# EAGLE schematic QS18-30-1 (EAGLE 6.1)
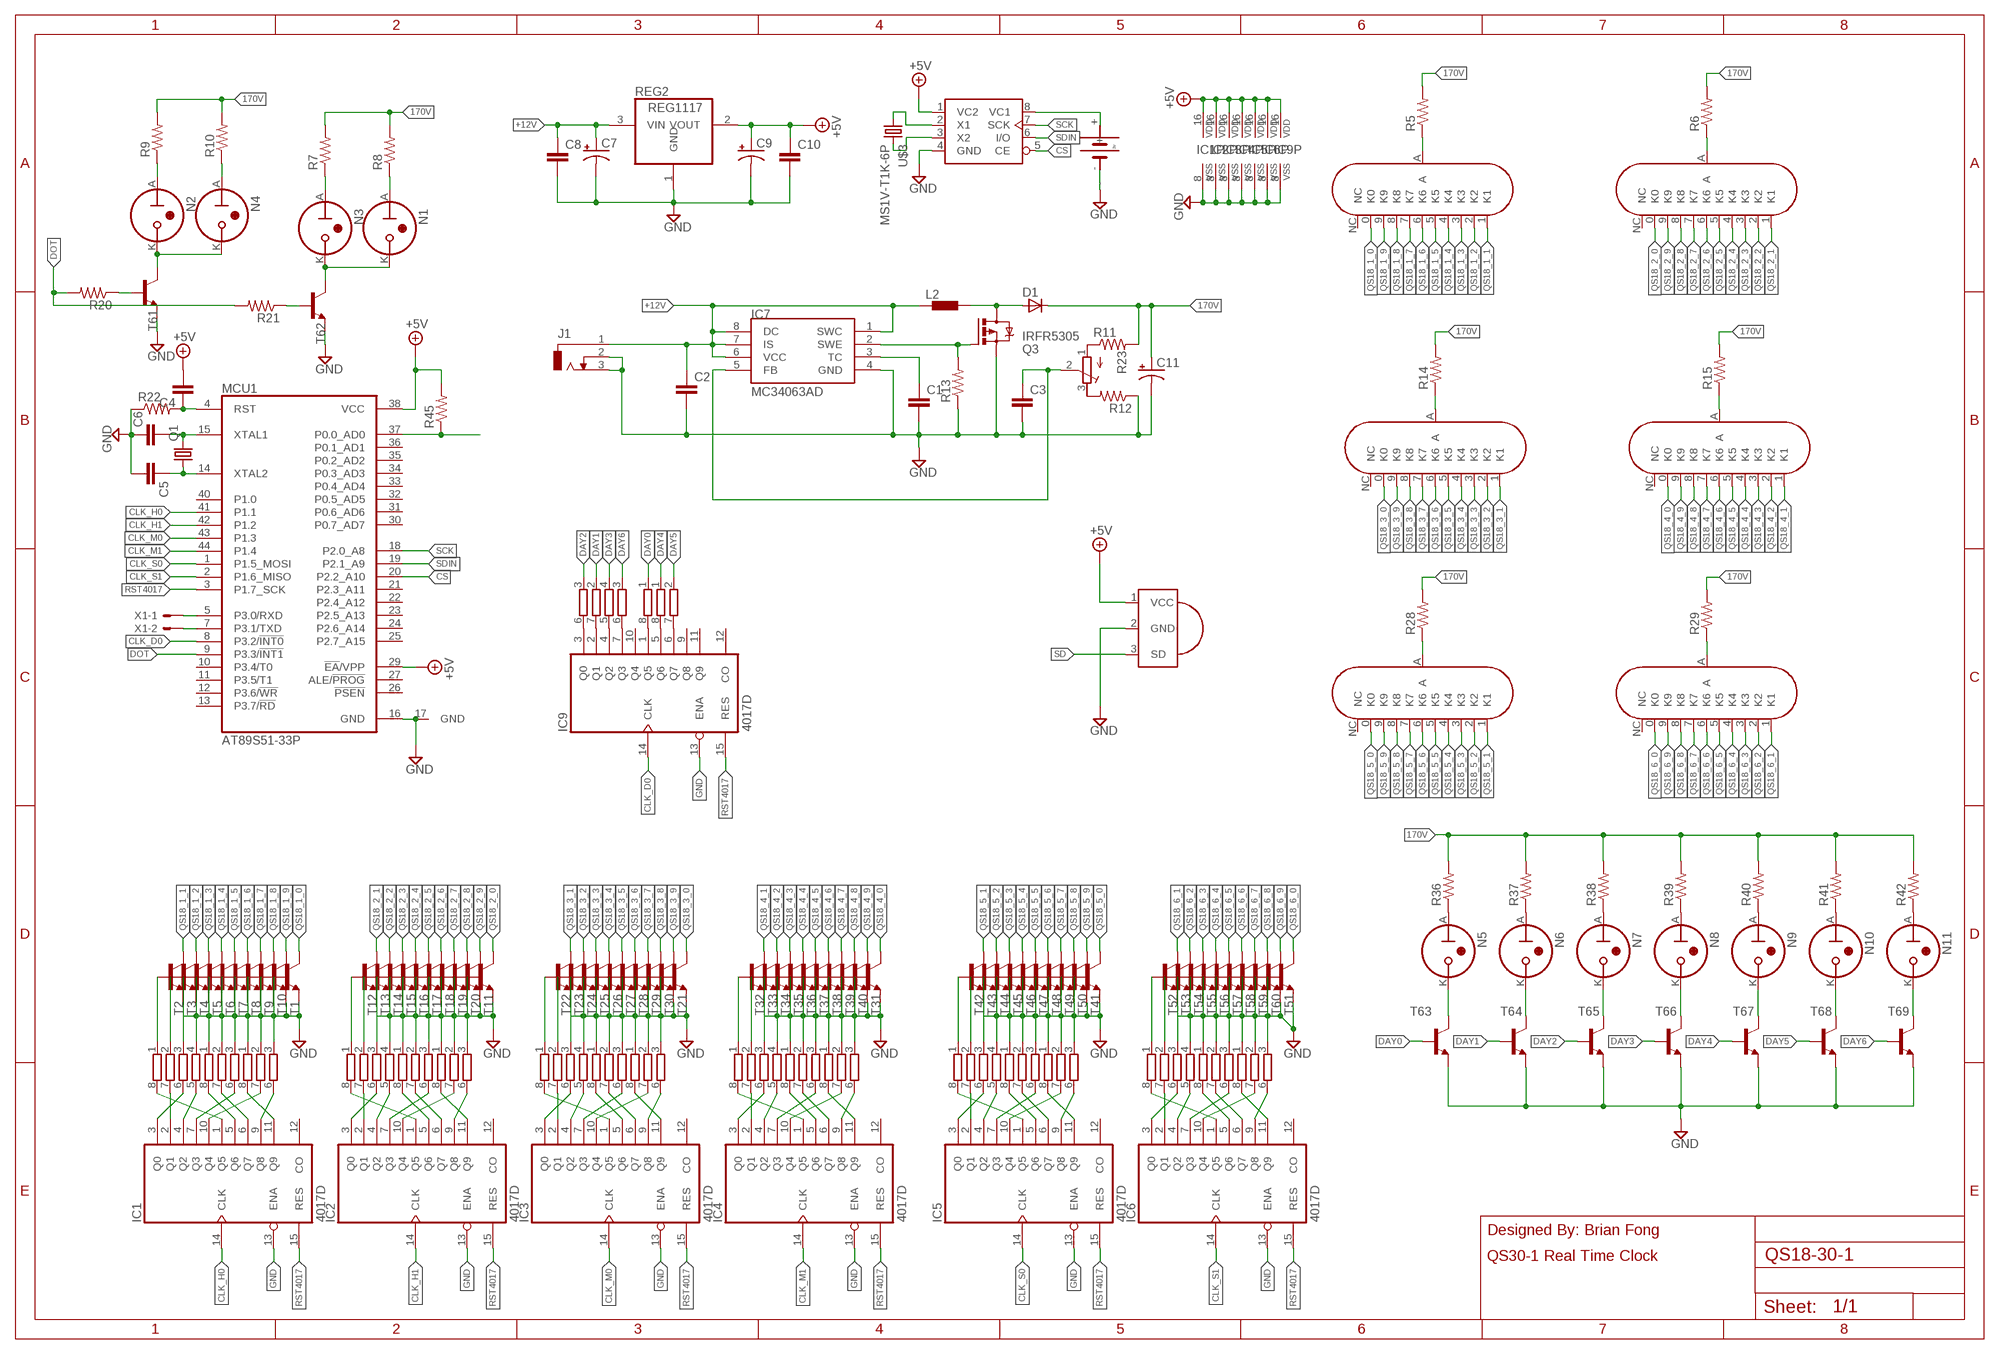
[diagram p0: schematic, sheet 1]

## Parts
C1  C-EUC0805  [C0805]
C2  C-EUC0805  [C0805]
C3  C-EUC0805  [C0805]
C4  C-EUC1206  [C1206]
C5  C-EUC0805  [C0805]
C6  C-EUC0805  [C0805]
C7  CPOL-USB/3528-21R  [B/3528-21R]
C8  C-EUC0805  [C0805]
C9  CPOL-USB/3528-21R  [B/3528-21R]
C10  C-EUC0805  [C0805]
C11  CPOL-USG  [PANASONIC_G]
D1  D-SMB  [SMB]
IC1  4017D  [SO16]
IC2  4017D  [SO16]
IC3  4017D  [SO16]
IC4  4017D  [SO16]
IC5  4017D  [SO16]
IC6  4017D  [SO16]
IC7  MC34063AD  [SOIC8]
IC9  4017D  [SO16]
J1  DCJ0303  [DCJ0303]
L2  DR10301033  [DR1033]
MCU1  AT89S51-33P  [TQFP44]
N1  IN-3  [IN-3]
N2  IN-3  [IN-3]
N3  IN-3  [IN-3]
N4  IN-3  [IN-3]
N5  IN-3  [IN-3]
N6  IN-3  [IN-3]
N7  IN-3  [IN-3]
N8  IN-3  [IN-3]
N9  IN-3  [IN-3]
N10  IN-3  [IN-3]
N11  Mon  IN-3  [IN-3]
Q1  CRYSTALHC49UP  [HC49UP]
Q3  IRFR5305  [D-PAK_TO252AA]
R1  4R-NEXB38V  [EXB38V]
R2  4R-NEXB38V  [EXB38V]
R3  4R-NEXB38V  [EXB38V]
R4  4R-NEXB38V  [EXB38V]
R5  R-US_M0805  [M0805]
R6  R-US_M0805  [M0805]
R7  R-US_M0805  [M0805]
R8  R-US_M0805  [M0805]
R9  R-US_M0805  [M0805]
R10  R-US_M0805  [M0805]
R11  R-US_R0805  [R0805]
R12  R-US_R0805  [R0805]
R13  R-US_R0805  [R0805]
R14  R-US_M0805  [M0805]
R15  R-US_M0805  [M0805]
R16  4R-NEXB38V  [EXB38V]
R17  4R-NEXB38V  [EXB38V]
R18  4R-NEXB38V  [EXB38V]
R19  4R-NEXB38V  [EXB38V]
R20  R-US_M0805  [M0805]
R21  R-US_M0805  [M0805]
R22  R-US_M0805  [M0805]
R23  R-TRIMM3374  [RTRIM3374]
R24  4R-NEXB38V  [EXB38V]
R25  4R-NEXB38V  [EXB38V]
R26  4R-NEXB38V  [EXB38V]
R27  4R-NEXB38V  [EXB38V]
R28  R-US_M0805  [M0805]
R29  R-US_M0805  [M0805]
R30  4R-NEXB38V  [EXB38V]
R31  4R-NEXB38V  [EXB38V]
R32  4R-NEXB38V  [EXB38V]
R33  4R-NEXB38V  [EXB38V]
R34  4R-NEXB38V  [EXB38V]
R35  4R-NEXB38V  [EXB38V]
R36  R-US_M0805  [M0805]
R37  R-US_M0805  [M0805]
R38  R-US_M0805  [M0805]
R39  R-US_M0805  [M0805]
R40  R-US_M0805  [M0805]
R41  R-US_M0805  [M0805]
R42  R-US_M0805  [M0805]
R43  4R-NEXB38V  [EXB38V]
R44  4R-NEXB38V  [EXB38V]
R45  R-US_M0805  [M0805]
REG2  REG1117  [SOT223]
T1  MMBT5551LT1-NPN-SOT23-BEC  [SOT23-BEC]
T2  MMBT5551LT1-NPN-SOT23-BEC  [SOT23-BEC]
T3  MMBT5551LT1-NPN-SOT23-BEC  [SOT23-BEC]
T4  MMBT5551LT1-NPN-SOT23-BEC  [SOT23-BEC]
T5  MMBT5551LT1-NPN-SOT23-BEC  [SOT23-BEC]
T6  MMBT5551LT1-NPN-SOT23-BEC  [SOT23-BEC]
T7  MMBT5551LT1-NPN-SOT23-BEC  [SOT23-BEC]
T8  MMBT5551LT1-NPN-SOT23-BEC  [SOT23-BEC]
T9  MMBT5551LT1-NPN-SOT23-BEC  [SOT23-BEC]
T10  MMBT5551LT1-NPN-SOT23-BEC  [SOT23-BEC]
T11  MMBT5551LT1-NPN-SOT23-BEC  [SOT23-BEC]
T12  MMBT5551LT1-NPN-SOT23-BEC  [SOT23-BEC]
T13  MMBT5551LT1-NPN-SOT23-BEC  [SOT23-BEC]
T14  MMBT5551LT1-NPN-SOT23-BEC  [SOT23-BEC]
T15  MMBT5551LT1-NPN-SOT23-BEC  [SOT23-BEC]
T16  MMBT5551LT1-NPN-SOT23-BEC  [SOT23-BEC]
T17  MMBT5551LT1-NPN-SOT23-BEC  [SOT23-BEC]
T18  MMBT5551LT1-NPN-SOT23-BEC  [SOT23-BEC]
T19  MMBT5551LT1-NPN-SOT23-BEC  [SOT23-BEC]
T20  MMBT5551LT1-NPN-SOT23-BEC  [SOT23-BEC]
T21  MMBT5551LT1-NPN-SOT23-BEC  [SOT23-BEC]
T22  MMBT5551LT1-NPN-SOT23-BEC  [SOT23-BEC]
T23  MMBT5551LT1-NPN-SOT23-BEC  [SOT23-BEC]
T24  MMBT5551LT1-NPN-SOT23-BEC  [SOT23-BEC]
T25  MMBT5551LT1-NPN-SOT23-BEC  [SOT23-BEC]
T26  MMBT5551LT1-NPN-SOT23-BEC  [SOT23-BEC]
T27  MMBT5551LT1-NPN-SOT23-BEC  [SOT23-BEC]
T28  MMBT5551LT1-NPN-SOT23-BEC  [SOT23-BEC]
T29  MMBT5551LT1-NPN-SOT23-BEC  [SOT23-BEC]
T30  MMBT5551LT1-NPN-SOT23-BEC  [SOT23-BEC]
T31  MMBT5551LT1-NPN-SOT23-BEC  [SOT23-BEC]
T32  MMBT5551LT1-NPN-SOT23-BEC  [SOT23-BEC]
T33  MMBT5551LT1-NPN-SOT23-BEC  [SOT23-BEC]
T34  MMBT5551LT1-NPN-SOT23-BEC  [SOT23-BEC]
T35  MMBT5551LT1-NPN-SOT23-BEC  [SOT23-BEC]
T36  MMBT5551LT1-NPN-SOT23-BEC  [SOT23-BEC]
T37  MMBT5551LT1-NPN-SOT23-BEC  [SOT23-BEC]
T38  MMBT5551LT1-NPN-SOT23-BEC  [SOT23-BEC]
T39  MMBT5551LT1-NPN-SOT23-BEC  [SOT23-BEC]
T40  MMBT5551LT1-NPN-SOT23-BEC  [SOT23-BEC]
T41  MMBT5551LT1-NPN-SOT23-BEC  [SOT23-BEC]
T42  MMBT5551LT1-NPN-SOT23-BEC  [SOT23-BEC]
T43  MMBT5551LT1-NPN-SOT23-BEC  [SOT23-BEC]
T44  MMBT5551LT1-NPN-SOT23-BEC  [SOT23-BEC]
T45  MMBT5551LT1-NPN-SOT23-BEC  [SOT23-BEC]
T46  MMBT5551LT1-NPN-SOT23-BEC  [SOT23-BEC]
T47  MMBT5551LT1-NPN-SOT23-BEC  [SOT23-BEC]
T48  MMBT5551LT1-NPN-SOT23-BEC  [SOT23-BEC]
T49  MMBT5551LT1-NPN-SOT23-BEC  [SOT23-BEC]
T50  MMBT5551LT1-NPN-SOT23-BEC  [SOT23-BEC]
T51  MMBT5551LT1-NPN-SOT23-BEC  [SOT23-BEC]
T52  MMBT5551LT1-NPN-SOT23-BEC  [SOT23-BEC]
T53  MMBT5551LT1-NPN-SOT23-BEC  [SOT23-BEC]
T54  MMBT5551LT1-NPN-SOT23-BEC  [SOT23-BEC]
T55  MMBT5551LT1-NPN-SOT23-BEC  [SOT23-BEC]
T56  MMBT5551LT1-NPN-SOT23-BEC  [SOT23-BEC]
T57  MMBT5551LT1-NPN-SOT23-BEC  [SOT23-BEC]
T58  MMBT5551LT1-NPN-SOT23-BEC  [SOT23-BEC]
T59  MMBT5551LT1-NPN-SOT23-BEC  [SOT23-BEC]
T60  MMBT5551LT1-NPN-SOT23-BEC  [SOT23-BEC]
T61  MMBT5551LT1-NPN-SOT23-BEC  [SOT23-BEC]
T62  MMBT5551LT1-NPN-SOT23-BEC  [SOT23-BEC]
T63  MMBT5551LT1-NPN-SOT23-BEC  [SOT23-BEC]
T64  MMBT5551LT1-NPN-SOT23-BEC  [SOT23-BEC]
T65  MMBT5551LT1-NPN-SOT23-BEC  [SOT23-BEC]
T66  MMBT5551LT1-NPN-SOT23-BEC  [SOT23-BEC]
T67  MMBT5551LT1-NPN-SOT23-BEC  [SOT23-BEC]
T68  MMBT5551LT1-NPN-SOT23-BEC  [SOT23-BEC]
T69  MMBT5551LT1-NPN-SOT23-BEC  [SOT23-BEC]
TUBE1  QS30-1R1  [QS30-1_V3]
TUBE2  QS30-1R1  [QS30-1_V3]
TUBE3  QS30-1R1  [QS30-1_V3]
TUBE4  QS30-1R1  [QS30-1_V3]
TUBE5  QS30-1R1  [QS30-1_V3]
TUBE6  QS30-1R1  [QS30-1_V3]
U$1  DS1302SOP08  [SOP08]
U$2  1220BATTERY_SF  [1220BATTERY]
U$3  MS1V-T1K-6P  [MS1V-T1K]
U$4  HX1838  [TO92-]
X1  332-02  [332-02]

## Nets
170V: C11.+ D1.1(C) R5.2 R6.2 R7.2 R8.2 R9.2 R10.2 R11.2 R14.2 R15.2 R28.2 R29.2 R36.2 R37.2 R38.2 R39.2 R40.2 R41.2 R42.2
+5V: C4.2 C9.+ C10.1 IC1.16(VDD) IC2.16(VDD) IC3.16(VDD) IC4.16(VDD) IC5.16(VDD) IC6.16(VDD) IC9.16(VDD) MCU1.29(!EA!/VPP) MCU1.38(VCC) R45.2 REG2.2(VOUT) U$1.1(VC2) U$4.1(VCC)
+12V: C2.1 C7.+ C8.1 IC7.1(SWC) IC7.6(VCC) IC7.7(IS) IC7.8(DC) J1.1 L2.1 REG2.3(VIN)
CLK_D0: IC9.14(CLK) MCU1.8(P3.2/!INT0)
CLK_H0: IC1.14(CLK) MCU1.41(P1.1)
CLK_H1: IC2.14(CLK) MCU1.42(P1.2)
CLK_M0: IC3.14(CLK) MCU1.43(P1.3)
CLK_M1: IC4.14(CLK) MCU1.44(P1.4)
CLK_S0: IC5.14(CLK) MCU1.1(P1.5_MOSI)
CLK_S1: IC6.14(CLK) MCU1.2(P1.6_MISO)
CS: MCU1.20(P2.2_A10) U$1.5(CE)
DAY0: R43.1 T63.B
DAY1: R43.2 T64.B
DAY2: R43.3 T65.B
DAY3: R43.4 T66.B
DAY4: R44.1 T67.B
DAY5: R44.2 T68.B
DAY6: R44.3 T69.B
DOT: MCU1.9(P3.3/!INT1) R20.2 R21.2
GND: C1.2 C2.2 C3.2 C5.2 C6.1 C7.- C8.2 C9.- C10.2 C11.- IC1.8(VSS) IC1.13(ENA) IC2.8(VSS) IC2.13(ENA) IC3.8(VSS) IC3.13(ENA) IC4.8(VSS) IC4.13(ENA) IC5.8(VSS) IC5.13(ENA) IC6.8(VSS) IC6.13(ENA) IC7.4(GND) IC9.8(VSS) IC9.13(ENA) J1.2 J1.3 MCU1.16(GND) MCU1.17(GND) Q3.3(S) R12.1 R13.1 R22.1 REG2.1(GND) T1.E T2.E T3.E T4.E T5.E T6.E T7.E T8.E T9.E T10.E T11.E T12.E T13.E T14.E T15.E T16.E T17.E T18.E T19.E T20.E T21.E T22.E T23.E T24.E T25.E T26.E T27.E T28.E T29.E T30.E T31.E T32.E T33.E T34.E T35.E T36.E T37.E T38.E T39.E T40.E T41.E T42.E T43.E T44.E T45.E T46.E T47.E T48.E T49.E T50.E T51.E T52.E T53.E T54.E T55.E T56.E T57.E T58.E T59.E T60.E T61.E T62.E T63.E T64.E T65.E T66.E T67.E T68.E T69.E U$1.4(GND) U$2.- U$4.2(GND)
N$1: C5.1 MCU1.14(XTAL2) Q1.1
N$2: C6.2 MCU1.15(XTAL1) Q1.2
N$3: R1.1 T2.B
N$4: R1.2 T3.B
N$5: R1.3 T4.B
N$6: R4.1 T12.B
N$7: R1.4 T5.B
N$8: R2.1 T6.B
N$9: R2.2 T7.B
N$10: R2.3 T8.B
N$11: R3.1 T9.B
N$12: R3.2 T10.B
N$13: R3.3 T1.B
N$14: R4.2 T13.B
N$15: R4.3 T14.B
N$16: R4.4 T15.B
N$17: R16.1 T16.B
N$18: R16.2 T17.B
N$19: R16.3 T18.B
N$20: R17.1 T19.B
N$21: R17.2 T20.B
N$22: R17.3 T11.B
N$23: R14.1 TUBE3.A
N$24: R15.1 TUBE4.A
N$25: R5.1 TUBE1.A
N$26: R18.1 T22.B
N$27: R6.1 TUBE2.A
N$28: R18.2 T23.B
N$29: R18.3 T24.B
N$30: R18.4 T25.B
N$31: R19.1 T26.B
N$32: R19.2 T27.B
N$33: R19.3 T28.B
N$34: R24.1 T29.B
N$35: R24.2 T30.B
N$36: R24.3 T21.B
N$37: R25.1 T32.B
N$38: R25.2 T33.B
N$39: R25.3 T34.B
N$40: R25.4 T35.B
N$41: R26.1 T36.B
N$42: R26.2 T37.B
N$43: R26.3 T38.B
N$44: R27.1 T39.B
N$45: R27.2 T40.B
N$46: R27.3 T31.B
N$47: IC3.1(Q5) R18.8
N$48: IC3.2(Q1) R18.7
N$49: N3.A R7.1
N$50: N1.A R8.1
N$51: N2.A R9.1
N$52: N4.A R10.1
N$53: IC7.2(SWE) Q3.1(G) R13.2
N$54: MCU1.5(P3.0/RXD) X1.1
N$55: C1.1 IC7.3(TC)
N$56: C3.1 IC7.5(FB) R23.2(S)
N$57: D1.2(A) L2.2 Q3.4(D)
N$58: IC3.3(Q0) R18.6
N$59: IC3.4(Q2) R18.5
N$60: IC3.5(Q6) R19.8
N$61: MCU1.7(P3.1/TXD) X1.2
N$62: IC3.6(Q7) R19.7
N$63: IC3.7(Q3) R19.6
N$64: IC3.9(Q8) R24.6
N$65: IC3.11(Q9) R24.8
N$66: IC3.10(Q4) R24.7
N$67: IC4.3(Q0) R25.6
N$68: IC4.1(Q5) R25.8
N$69: IC4.2(Q1) R25.7
N$70: IC4.11(Q9) R27.8
N$71: IC4.9(Q8) R27.6
N$72: IC4.10(Q4) R27.7
N$73: IC4.4(Q2) R25.5
N$74: IC4.5(Q6) R26.8
N$75: IC4.6(Q7) R26.7
N$76: IC4.7(Q3) R26.6
N$77: IC1.1(Q5) R1.8
N$78: IC1.2(Q1) R1.7
N$79: IC1.3(Q0) R1.6
N$80: IC1.4(Q2) R1.5
N$81: IC1.5(Q6) R2.8
N$82: IC1.6(Q7) R2.7
N$83: IC1.7(Q3) R2.6
N$84: IC1.11(Q9) R3.8
N$85: IC1.10(Q4) R3.7
N$86: R28.1 TUBE5.A
N$87: IC1.9(Q8) R3.6
N$88: R29.1 TUBE6.A
N$89: N2.K N4.K T61.C
N$90: R20.1 T61.B
N$91: N1.K N3.K T62.C
N$92: R21.1 T62.B
N$93: IC2.1(Q5) R4.8
N$94: IC2.2(Q1) R4.7
N$95: IC2.3(Q0) R4.6
N$96: IC2.4(Q2) R4.5
N$97: IC2.5(Q6) R16.8
N$98: U$1.8(VC1) U$2.+
N$99: IC2.6(Q7) R16.7
N$100: IC2.7(Q3) R16.6
N$101: IC2.11(Q9) R17.8
N$102: IC2.10(Q4) R17.7
N$103: U$1.2(X1) U$3.P$1
N$104: C4.1 MCU1.4(RST) R22.2
N$105: U$1.3(X2) U$3.P$2
N$106: IC2.9(Q8) R17.6
N$107: R30.1 T42.B
N$108: R30.2 T43.B
N$109: R30.3 T44.B
N$110: R30.4 T45.B
N$111: R31.1 T46.B
N$112: R31.2 T47.B
N$113: R31.3 T48.B
N$114: R32.1 T49.B
N$115: R32.2 T50.B
N$116: R32.3 T41.B
N$117: R33.1 T52.B
N$118: R33.2 T53.B
N$119: R33.3 T54.B
N$120: R33.4 T55.B
N$121: R34.1 T56.B
N$122: R34.2 T57.B
N$123: R34.3 T58.B
N$124: R35.1 T59.B
N$125: R35.2 T60.B
N$126: R35.3 T51.B
N$127: IC5.1(Q5) R30.8
N$128: IC5.2(Q1) R30.7
N$129: IC5.3(Q0) R30.6
N$130: IC5.4(Q2) R30.5
N$131: IC5.5(Q6) R31.8
N$132: IC5.6(Q7) R31.7
N$133: IC5.7(Q3) R31.6
N$134: IC5.9(Q8) R32.6
N$135: IC5.11(Q9) R32.8
N$136: IC5.10(Q4) R32.7
N$137: IC6.3(Q0) R33.6
N$138: IC6.1(Q5) R33.8
N$139: IC6.2(Q1) R33.7
N$140: IC6.11(Q9) R35.8
N$141: IC6.9(Q8) R35.6
N$142: IC6.10(Q4) R35.7
N$143: IC6.4(Q2) R33.5
N$144: IC6.5(Q6) R34.8
N$145: IC6.6(Q7) R34.7
N$146: IC6.7(Q3) R34.6
N$147: N5.K T63.C
N$148: N6.K T64.C
N$149: N7.K T65.C
N$150: N8.K T66.C
N$151: N9.K T67.C
N$152: N10.K T68.C
N$153: N11.K T69.C
N$154: N5.A R36.1
N$155: N6.A R37.1
N$156: N8.A R39.1
N$157: N11.A R42.1
N$158: N10.A R41.1
N$159: N9.A R40.1
N$160: N7.A R38.1
N$161: R11.1 R23.1(E)
N$162: R12.2 R23.3(A)
N$163: IC9.1(Q5) R43.8
N$164: IC9.2(Q1) R43.7
N$165: IC9.3(Q0) R43.6
N$166: IC9.4(Q2) R43.5
N$167: IC9.7(Q3) R44.6
N$168: IC9.5(Q6) R44.8
N$169: IC9.6(Q7) R44.7
QS18_1_0: T1.C TUBE1.0(K0)
QS18_1_1: T2.C TUBE1.1(K1)
QS18_1_2: T3.C TUBE1.2(K2)
QS18_1_3: T4.C TUBE1.3(K3)
QS18_1_4: T5.C TUBE1.4(K4)
QS18_1_5: T6.C TUBE1.5(K5)
QS18_1_6: T7.C TUBE1.6(K6)
QS18_1_7: T8.C TUBE1.7(K7)
QS18_1_8: T9.C TUBE1.8(K8)
QS18_1_9: T10.C TUBE1.9(K9)
QS18_2_0: T11.C TUBE2.0(K0)
QS18_2_1: T12.C TUBE2.1(K1)
QS18_2_2: T13.C TUBE2.2(K2)
QS18_2_3: T14.C TUBE2.3(K3)
QS18_2_4: T15.C TUBE2.4(K4)
QS18_2_5: T16.C TUBE2.5(K5)
QS18_2_6: T17.C TUBE2.6(K6)
QS18_2_7: T18.C TUBE2.7(K7)
QS18_2_8: T19.C TUBE2.8(K8)
QS18_2_9: T20.C TUBE2.9(K9)
QS18_3_0: T21.C TUBE3.0(K0)
QS18_3_1: T22.C TUBE3.1(K1)
QS18_3_2: T23.C TUBE3.2(K2)
QS18_3_3: T24.C TUBE3.3(K3)
QS18_3_4: T25.C TUBE3.4(K4)
QS18_3_5: T26.C TUBE3.5(K5)
QS18_3_6: T27.C TUBE3.6(K6)
QS18_3_7: T28.C TUBE3.7(K7)
QS18_3_8: T29.C TUBE3.8(K8)
QS18_3_9: T30.C TUBE3.9(K9)
QS18_4_0: T31.C TUBE4.0(K0)
QS18_4_1: T32.C TUBE4.1(K1)
QS18_4_2: T33.C TUBE4.2(K2)
QS18_4_3: T34.C TUBE4.3(K3)
QS18_4_4: T35.C TUBE4.4(K4)
QS18_4_5: T36.C TUBE4.5(K5)
QS18_4_6: T37.C TUBE4.6(K6)
QS18_4_7: T38.C TUBE4.7(K7)
QS18_4_8: T39.C TUBE4.8(K8)
QS18_4_9: T40.C TUBE4.9(K9)
QS18_5_0: T41.C TUBE5.0(K0)
QS18_5_1: T42.C TUBE5.1(K1)
QS18_5_2: T43.C TUBE5.2(K2)
QS18_5_3: T44.C TUBE5.3(K3)
QS18_5_4: T45.C TUBE5.4(K4)
QS18_5_5: T46.C TUBE5.5(K5)
QS18_5_6: T47.C TUBE5.6(K6)
QS18_5_7: T48.C TUBE5.7(K7)
QS18_5_8: T49.C TUBE5.8(K8)
QS18_5_9: T50.C TUBE5.9(K9)
QS18_6_0: T51.C TUBE6.0(K0)
QS18_6_1: T52.C TUBE6.1(K1)
QS18_6_2: T53.C TUBE6.2(K2)
QS18_6_3: T54.C TUBE6.3(K3)
QS18_6_4: T55.C TUBE6.4(K4)
QS18_6_5: T56.C TUBE6.5(K5)
QS18_6_6: T57.C TUBE6.6(K6)
QS18_6_7: T58.C TUBE6.7(K7)
QS18_6_8: T59.C TUBE6.8(K8)
QS18_6_9: T60.C TUBE6.9(K9)
RST4017: IC1.15(RES) IC2.15(RES) IC3.15(RES) IC4.15(RES) IC5.15(RES) IC6.15(RES) IC9.15(RES) MCU1.3(P1.7_SCK)
SCK: MCU1.18(P2.0_A8) U$1.7(SCK)
SD: MCU1.37(P0.0_AD0) R45.1 U$4.3(SD)
SDIN: MCU1.19(P2.1_A9) U$1.6(I/O)
Unconnected: IC1.12(CO) IC2.12(CO) IC3.12(CO) IC4.12(CO) IC5.12(CO) IC6.12(CO) IC9.9(Q8) IC9.10(Q4) IC9.11(Q9) IC9.12(CO) MCU1.10(P3.4/T0) MCU1.11(P3.5/T1) MCU1.12(P3.6/!WR) MCU1.13(P3.7/!RD) MCU1.21(P2.3_A11) MCU1.22(P2.4_A12) MCU1.23(P2.5_A13) MCU1.24(P2.6_A14) MCU1.25(P2.7_A15) MCU1.26(!PSEN) MCU1.27(ALE/!PROG) MCU1.30(P0.7_AD7) MCU1.31(P0.6_AD6) MCU1.32(P0.5_AD5) MCU1.33(P0.4_AD4) MCU1.34(P0.3_AD3) MCU1.35(P0.2_AD2) MCU1.36(P0.1_AD1) MCU1.40(P1.0) R2.4 R2.5 R3.4 R3.5 R16.4 R16.5 R17.4 R17.5 R19.4 R19.5 R24.4 R24.5 R26.4 R26.5 R27.4 R27.5 R31.4 R31.5 R32.4 R32.5 R34.4 R34.5 R35.4 R35.5 R44.4 R44.5 TUBE1.NC TUBE2.NC TUBE3.NC TUBE4.NC TUBE5.NC TUBE6.NC

## Notes on the sheet
- Designed By: Brian Fong
- QS30-1 Real Time Clock

## Library data of the parts
C1-C3 = resistor:C-EU: CAPACITOR, European symbol
C4-C6 C8 C10 = rcl:C-EU: CAPACITOR, European symbol
C7 C9 = rcl:CPOL-US: POLARIZED CAPACITOR, American symbol
C11 = resistor:CPOL-US: POLARIZED CAPACITOR, American symbol
D1 = semicon-smd-ipc:D-: DIODE unfilled
IC1-IC6 IC9 = 40xx:4017: COUNTER/DIVIDER
IC7 = mc34063:MC34063
J1 = con-jack:DCJ0303: DC POWER JACK Source: DCJ0303.pdf; OC_FARNELL: unknown; OC_NEWARK: unknown
L2 = inductors:DR1030: DR1030 Series Low Profile Power Inductors Source: Data sheet <http://www.cooperbussmann.com/pdf/c73e479f-f867-4c64-ae26-9c1f23814163.pdf>
MCU1 = atmel:AT89S51*P: 8-bit Microcontroller with 4K BytesIn-System Programmable Flash Source: http://www.atmel.com/dyn/resources/prod_documents/doc2487.pdf; OC_FARNELL: unknown; OC_NEWARK: unknown
N1-N11 = russian-nixies:IN-3: IN-3: nixie bulb
Q1 = crystal:CRYSTAL: CRYSTAL; OC_FARNELL: unknown; OC_NEWARK: unknown
Q3 = transistor-power:IRF?5305: HEXFET Power MOSFET Source: http://www.irf.com/product-info/datasheets/data/irfr5305pbf.pdf
R1-R4 R16-R19 R24-R27 R30-R35 R43 R44 = resistor-dil:4R-N: Array Chip Resistor Source: RS Component / Phycomp; OC_FARNELL: unknown; OC_NEWARK: unknown
R5-R15 R20-R22 R28 R29 R36-R42 R45 = rcl:R-US_: RESISTOR, American symbol
R23 = resistor:R-TRIMM: Trimm resistor
REG2 = burr-brown:REG1117: 800mA and 1A Low Dropout (LDO) Positive Regulator 1.8V, 2.5V, 2.85V, 3.3V, 5V, and Adj; MPN: REG1117; OC_FARNELL: 1097566; OC_NEWARK: 14P6981
T1-T69 = transistor:*-NPN-: NPN Transistror BF959 corrected 2008.03.06
TUBE1-TUBE6 = nixie_tube:QS30-1
U$1 = 2ref-packages-longpad:DS1302
U$2 = battery2:1220BATTERY_SF
U$3 = crystal:MS1V-T1K-6P
U$4 = 2ref-packages-longpad:HX1838
X1 = con-garry:332-02: 2 Pin - 2mm Dual Row Source: www.mpe-connector.de / garry_shortform_2012.pdf